# EAGLE schematic LED-TEST-Eagle (EAGLE 9.6.2)
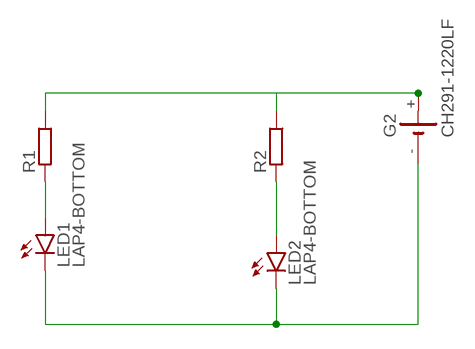
[diagram p0: schematic, sheet 1]

## Parts
G2  CH291-1220LF  [CH291-1220LF]
LED1  LAP4-BOTTOM  [P47F-BOTTOM]
LED2  LAP4-BOTTOM  [P47F-BOTTOM]
R1  SMT-WAV  [SMT-WAV]
R2  SMT-WAV  [SMT-WAV]

## Nets
N$1: G2.+ R1.1 R2.1
N$2: LED2.A R2.2
N$3: LED1.A R1.2
N$4: G2.- LED1.C LED2.C

## Library data of the parts
G2 = battery:CH291-1220LF: Battery Holder, SMT, 12mm multicomp PART NO. CH291-1220LF Source: Data sheet <http://www.farnell.com/datasheets/1505860.pdf>
LED1 LED2 = led:*P4: PointLED® Enhanced Thinfilm LED TOP & BOTTOM mount LS P47F, LR P47F, LA P47F, LY P47F, LT P4SG, LB P4SG, LW P4SG Source: http://catalog.osram-os.com .. LA_LR_LS_LY_P47F_Pb_free.pdf
R1 R2 = resistor-shunt:SMT-WAV: SMD SHUNT RESISTOR; OC_FARNELL: unknown; OC_NEWARK: unknown